# EasyEDA schematic SCH_UPS_monitor_2026-08-25.json
TITLE: UPS monitoring hardware; REV: 1.0; Date: 2026-08-25; Sheet: 1/1; Company: PAL
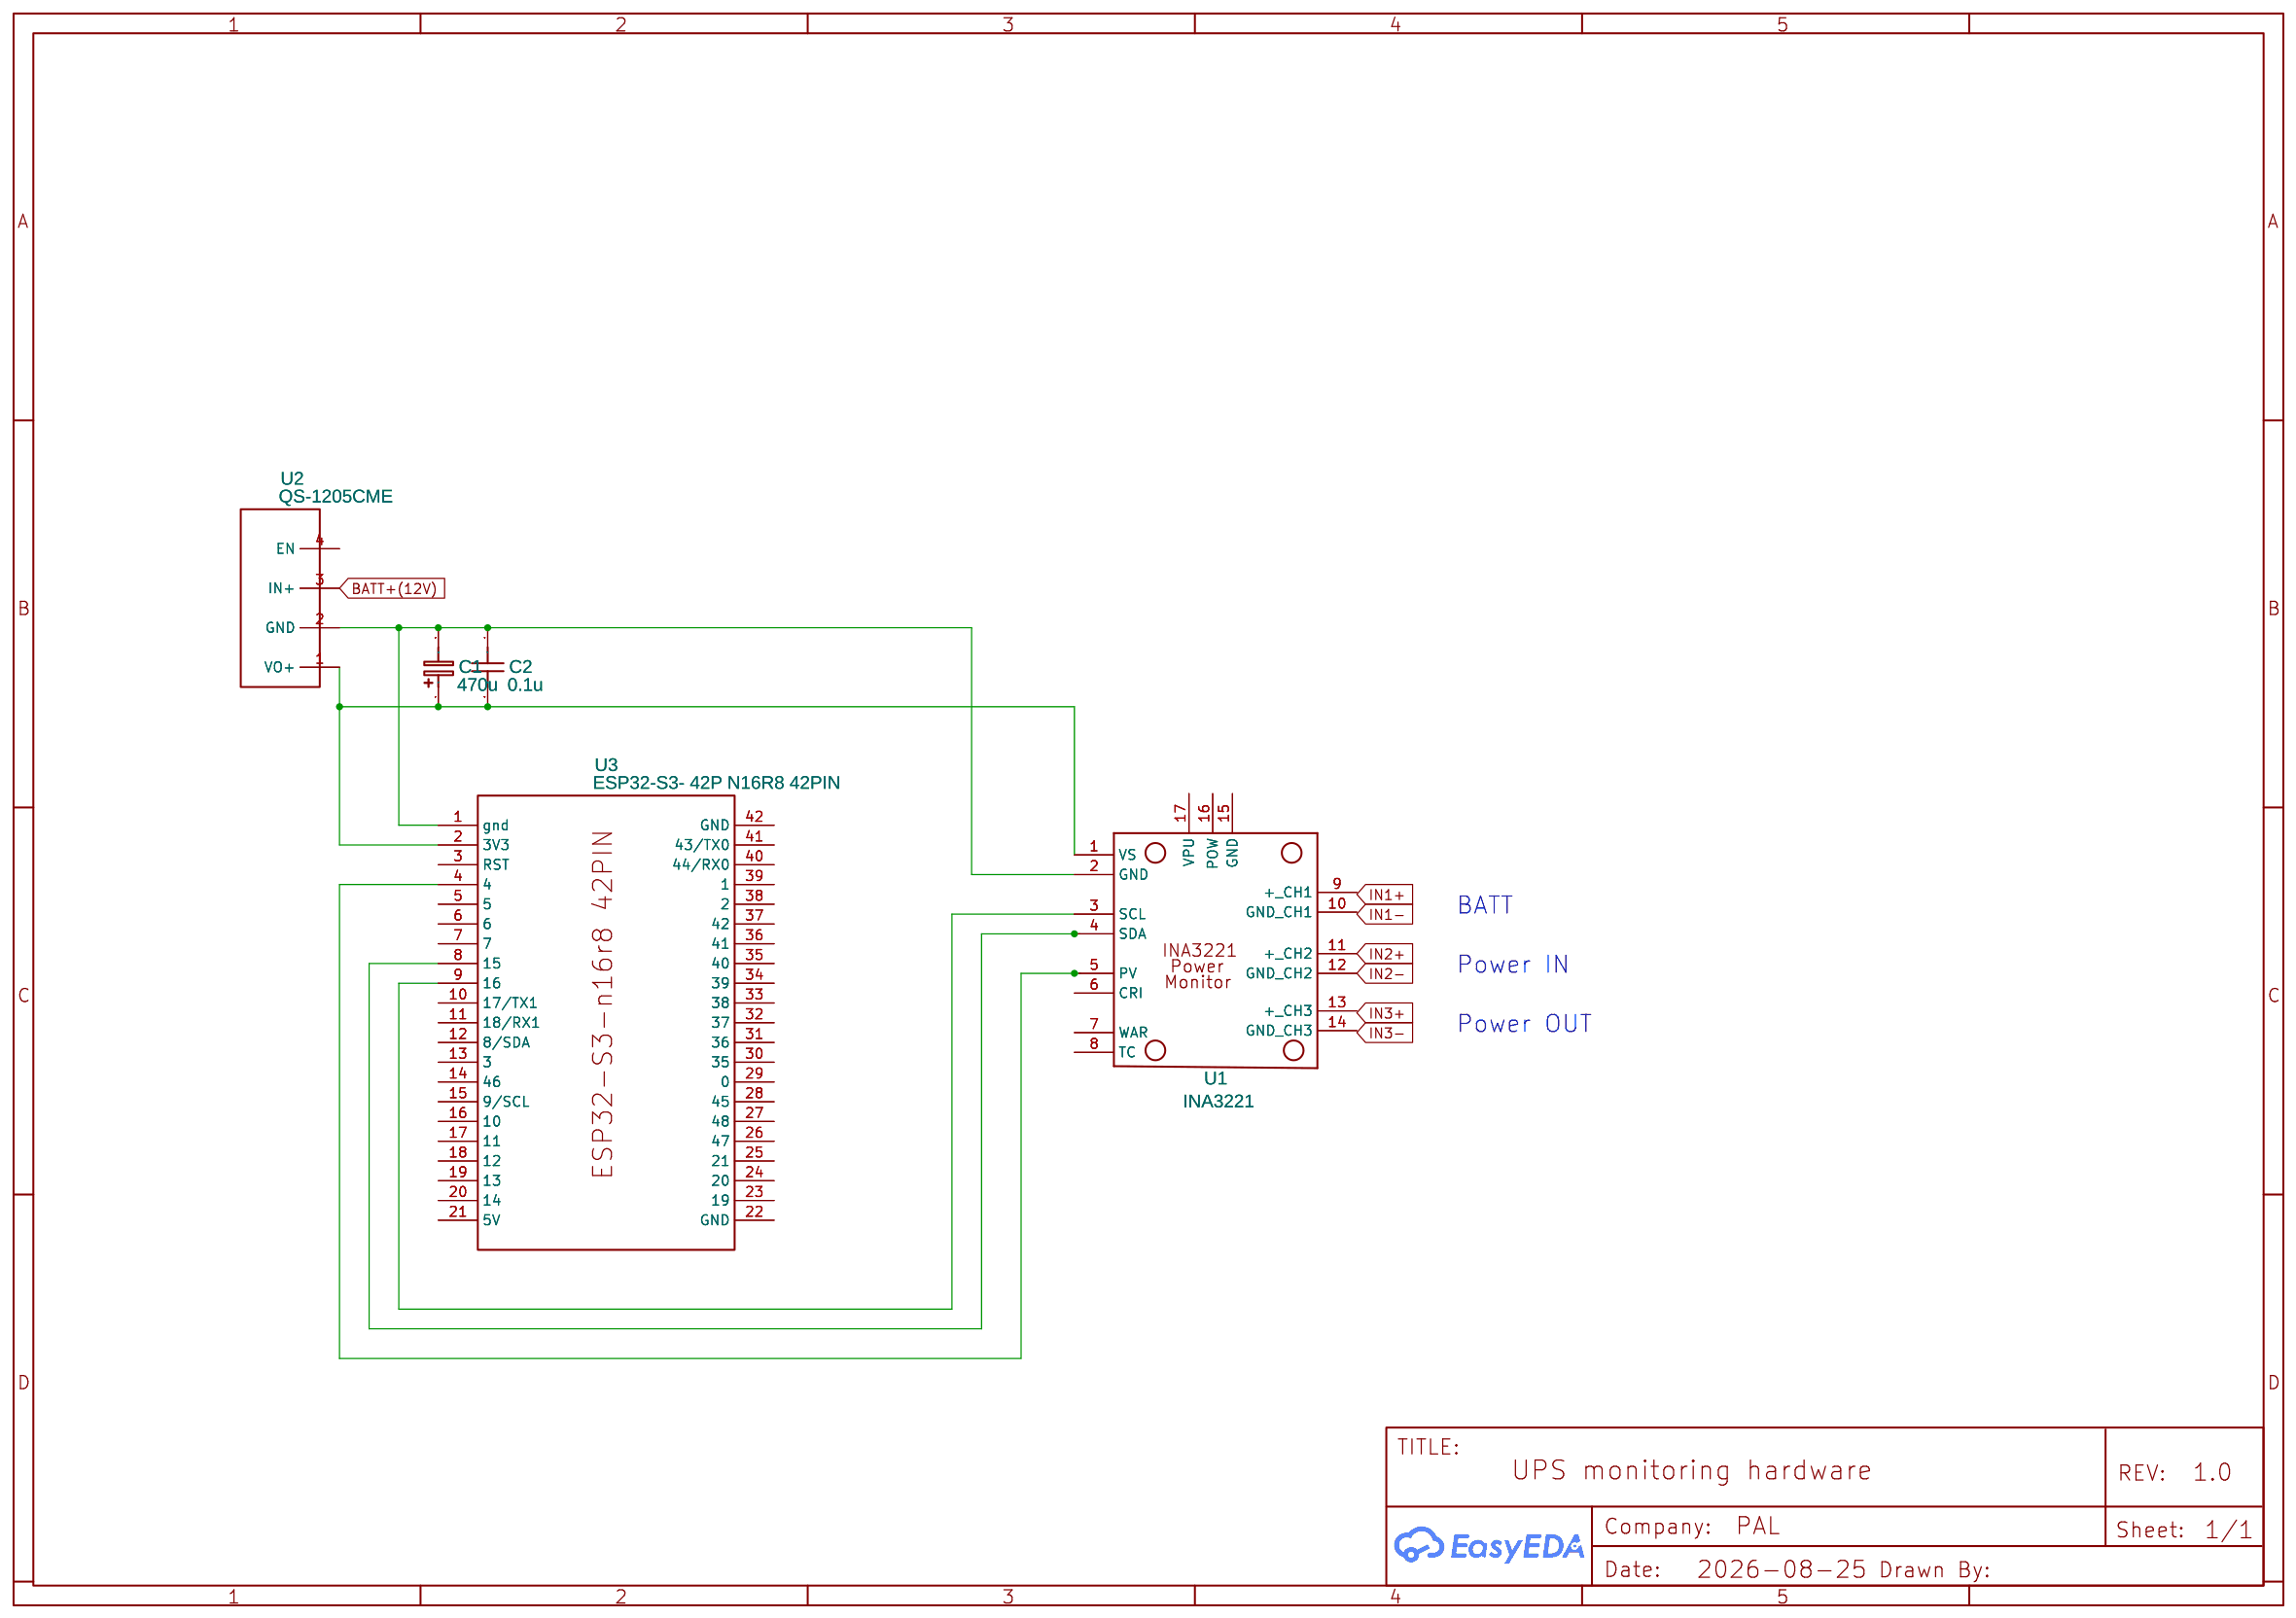
[diagram p0: schematic sheet]

## Parts
C1  470u  [CASE-A_3216]
C2  0.1u  [C0603]
U1  INA3221  [INA3221-PCB-V1]
U2  QS-1205CME  [QS-1205CME-3A POWER MODULE]
U3  ESP32-S3- 42P N16R8 42PIN  [ESP32-S3-DEVKITC-1-N16R8]

## Library data of the parts
C1 = C_Tan_SMD_A_EU: Contributor: LCEDA_Lib
C2 = C_0603_US: Contributor: LCEDA_Lib
U1 = INA3221 ALIEXPRESS NEW MOD: Contributor: mcmiha
U2 = QS-1205CME: Manufacturer: EGBO Store; Manufacturer Part: Mini-DC-DC; Supplier: Aliexpress; Supplier Part: QS-1205CME-3A; link: https://de.aliexpress.com/item/1005005393995240.html?spm=a2g0o.order_list.order_list_main.5.21ef5c5fQXlnbu&gatewayAdapt=glo2deu; Contributor: vincc
U3 = ESP32-S3- 42P N16R8 42PIN: Supplier: ESPRESSIF; Contributor: Robin Samuel

## Nets
BATT+(12V): U2.3(IN+)
IN2+: U1.11(+ CH2)
IN2-: U1.12(GND CH2)
Net-(C1-1): C1.1 C2.2 U1.1(VS) U2.1(VO+) U3.2(3V3)
Net-(C1-2): C1.2 C2.1 U1.2(GND) U2.2(GND) U3.1(gnd)
Net-(U1-3): U1.3(SCL) U3.9(16)
Net-(U1-4): U1.4(SDA) U3.8(15)
Net-(U1-5): U1.5(PV) U3.4

Not connected (* = marked no-connect by the designer): U1 6(CRI) 7(WAR) 8(TC) 9(+ CH1) 10(GND CH1) 13(+ CH3) 14(GND CH3) 15(GND) 16(POW) 17(VPU); U2 4(EN); U3 3(RST) 5 6 7 10(17/TX1) 11(18/RX1) 12(8/SDA) 13(3) 14(46) 15(9/SCL) 16(10) 17(11) 18(12) 19(13) 20(14) 21(5V) 22(GND) 23(19) 24(20) 25(21) 26(47) 27(48) 28(45) 29(0) 30(35) 31(36) 32(37) 33(38) 34(39) 35(40) 36(41) 37(42) 38(2) 39(1) 40(44/RX0) 41(43/TX0) 42(GND)

## Notes on the sheet
- BATT
- Power IN
- Power OUT
